# Altium schematic sheet Sheet3.SchDoc
size 420 x 297 mm; SheetNumber: 3; SheetTotal: 3
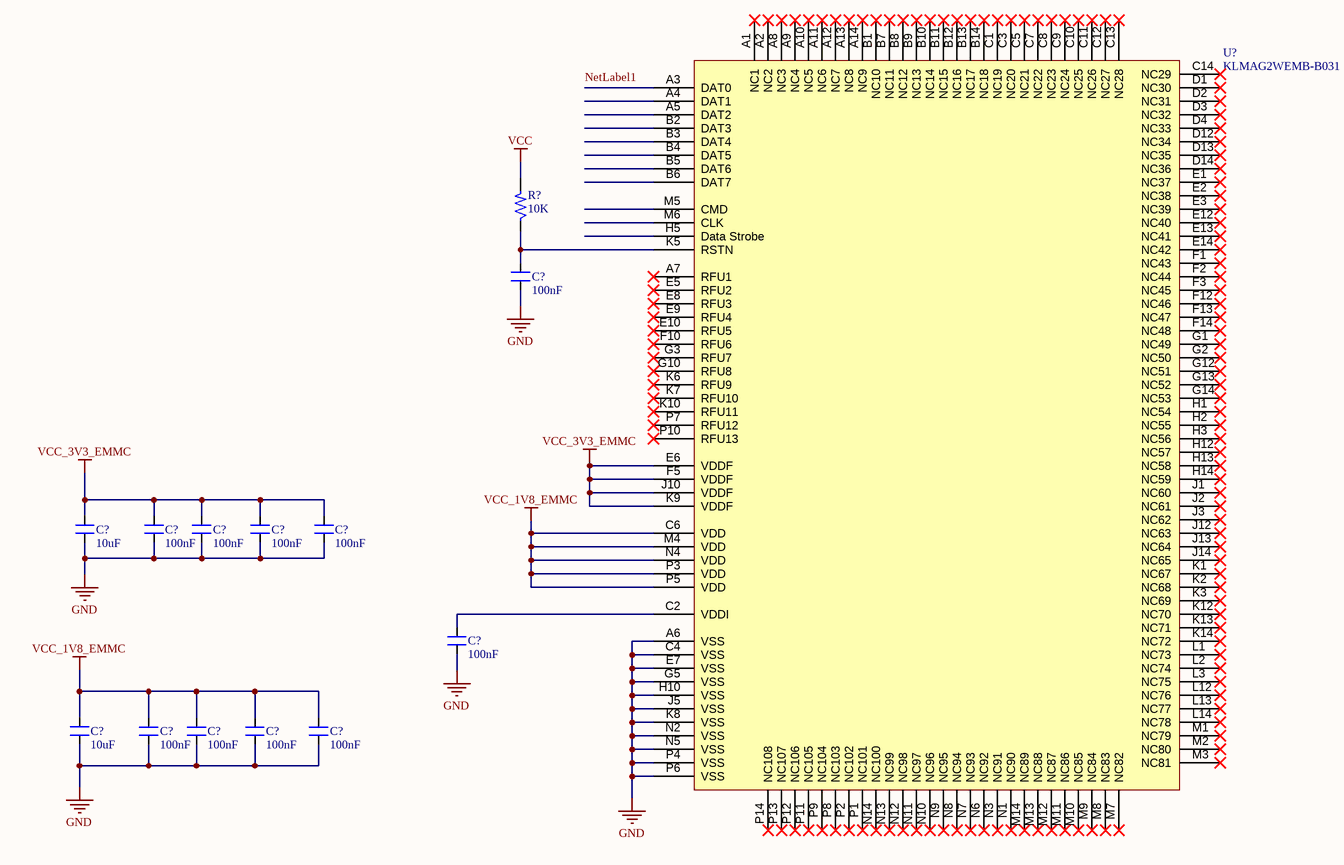
[diagram p0: Sheet3.SchDoc]

## Parts
(Parts that share a designator on the sheet are numbered #1, #2 ... from top to bottom, then left to right.)
C?#1  100nF  [CAP_0402]
C?#2  10uF  [CAP_0603]
C?#3  100nF  [CAP_0402]
C?#4  100nF  [CAP_0402]
C?#5  100nF  [CAP_0402]
C?#6  100nF  [CAP_0402]
C?#7  100nF  [CAP_0402]
C?#8  10uF  [CAP_0603]
C?#9  100nF  [CAP_0402]
C?#10  100nF  [CAP_0402]
C?#11  100nF  [CAP_0402]
C?#12  100nF  [CAP_0402]
R?  10K  [RES_0201]
U?  KLMAG2WEMB-B031  [BGA153C50P14X14_1150X1300X70]

## Nets
GND: C?#1.1 C?#2.1 C?#3.1 C?#4.1 C?#5.1 C?#6.1 C?#7.1 C?#8.1 C?#9.1 C?#10.1 C?#11.1 C?#12.1 U?.A6(VSS) U?.C4(VSS) U?.E7(VSS) U?.G5(VSS) U?.H10(VSS) U?.J5(VSS) U?.K8(VSS) U?.N2(VSS) U?.N5(VSS) U?.P4(VSS) U?.P6(VSS)
VCC: R?.2
VCC_1V8_EMMC: C?#8.2 C?#9.2 C?#10.2 C?#11.2 C?#12.2 U?.C6(VDD) U?.M4(VDD) U?.N4(VDD) U?.P3(VDD) U?.P5(VDD)
VCC_3V3_EMMC: C?#2.2 C?#3.2 C?#4.2 C?#5.2 C?#6.2 U?.E6(VDDF) U?.F5(VDDF) U?.J10(VDDF) U?.K9(VDDF)
NetC?#1_2: C?#1.2 R?.1 U?.K5(RSTN)
NetC?#7_2: C?#7.2 U?.C2(VDDI)

Not connected (* = marked no-connect by the designer): U? A1(NC1)* A2(NC2)* A3(DAT0) A4(DAT1) A5(DAT2) A7(RFU1)* A8(NC3)* A9(NC4)* A10(NC5)* A11(NC6)* A12(NC7)* A13(NC8)* A14(NC9)* B1(NC10)* B2(DAT3) B3(DAT4) B4(DAT5) B5(DAT6) B6(DAT7) B7(NC11)* B8(NC12)* B9(NC13)* B10(NC14)* B11(NC15)* B12(NC16)* B13(NC17)* B14(NC18)* C1(NC19)* C3(NC20)* C5(NC21)* C7(NC22)* C8(NC23)* C9(NC24)* C10(NC25)* C11(NC26)* C12(NC27)* C13(NC28)* C14(NC29)* D1(NC30)* D2(NC31)* D3(NC32)* D4(NC33)* D12(NC34)* D13(NC35)* D14(NC36)* E1(NC37)* E2(NC38)* E3(NC39)* E5(RFU2)* E8(RFU3)* E9(RFU4)* E10(RFU5)* E12(NC40)* E13(NC41)* E14(NC42)* F1(NC43)* F2(NC44)* F3(NC45)* F10(RFU6)* F12(NC46)* F13(NC47)* F14(NC48)* G1(NC49)* G2(NC50)* G3(RFU7)* G10(RFU8)* G12(NC51)* G13(NC52)* G14(NC53)* H1(NC54)* H2(NC55)* H3(NC56)* H5(Data_Strobe) H12(NC57)* H13(NC58)* H14(NC59)* J1(NC60)* J2(NC61)* J3(NC62)* J12(NC63)* J13(NC64)* J14(NC65)* K1(NC67)* K2(NC68)* K3(NC69)* K6(RFU9)* K7(RFU10)* K10(RFU11)* K12(NC70)* K13(NC71)* K14(NC72)* L1(NC73)* L2(NC74)* L3(NC75)* L12(NC76)* L13(NC77)* L14(NC78)* M1(NC79)* M2(NC80)* M3(NC81)* M5(CMD) M6(CLK) M7(NC82)* M8(NC83)* M9(NC84)* M10(NC85)* M11(NC86)* M12(NC87)* M13(NC88)* M14(NC89)* N1(NC90)* N3(NC91)* N6(NC92)* N7(NC93)* N8(NC94)* N9(NC95)* N10(NC96)* N11(NC97)* N12(NC98)* N13(NC99)* N14(NC100)* P1(NC101)* P2(NC102)* P7(RFU12)* P8(NC103)* P9(NC104)* P10(RFU13)* P11(NC105)* P12(NC106)* P13(NC107)* P14(NC108)*

## Notes on the sheet
- Labels drawn without touching a wire or pin: NetLabel1
- THIS DOCUMENT AND THE DATA DISCLOSED HEREIN OR
- HEREWITH IS THE PROPERTY OF ALTIUM LIMITED AND MAY
- DWG NO:
- REVISION
- REV:
- DESCRIPTION
- DATE
- APPROVED
- BE FREELY DISTRIBUTED IN WHOLE. NO RIGHTS ARE
- RESERVED OR EXPRESS OR IMPLIED WARANTEE GIVEN.
- ENG:
- APPROVALS
- PROJECT
- DSN:
- CHK:
- REFERENCE DOCUMENTS
- PROJECT REVISION:
- TITLE
- DOCUMENT REVISION:
- DESIGN ITEM:
- BOM:
- FAB DWG:
- PCB DWG:
- ASSY DWG:
- SCALE:
- A3
- SIZE
- CAGE CODE
- FILE NAME
- DWG NO.
- SHEET
- OF
- REV

## Library data of the parts
C?#1 C?#7 = CAP_100nF-10V-10%-0402: 0.1µF ±10% 10V Ceramic Capacitor X7R 0402 (1005 Metric); Manufacturer: Yageo; Manufacturer Part Number: CC0402KRX7R6BB104; Case/Package: 0402; Supplier-1: Digikey
C?#2 C?#8 = CAP_10uF-25V-10%-0603: 10µF ±10% 25V Ceramic Capacitor X5R 0603 (1608 Metric); Manufacturer: Murata Electronics; Manufacturer Part Number: GRM188R61E106KA73D; Case/Package: 0603; Supplier-1: Digikey
C?#3-C?#6 C?#9-C?#12 = CAP_100nF-25V-10%-0402: 0.1µF ±10% 25V Ceramic Capacitor X7R 0402 (1005 Metric); Manufacturer: Walsin Technology Corporation; Manufacturer Part Number: 0402B104K250CT; Case/Package: 0402; Supplier-1: Digikey
R? = RES_10K-0.05W-1%-0201: 10 kOhms ±1% 0.05W, 1/20W Chip Resistor 0201 (0603 Metric) Thick Film; Manufacturer: Stackpole Electronics Inc; Manufacturer Part Number: RMCF0201FT10K0; Case/Package: 0201; Supplier-1: Digikey
U? = IC_KLMAG2WEMB-B031: 16GB NAND Flash Memory; Manufacturer: Samsung Electronics; Manufacturer Part Number: KLMAG2WEMB-B031; Case/Package: 153-FBGA; Supplier-1: NA